# EAGLE design Woolllf Open Weeve (EAGLE 9.6.2)
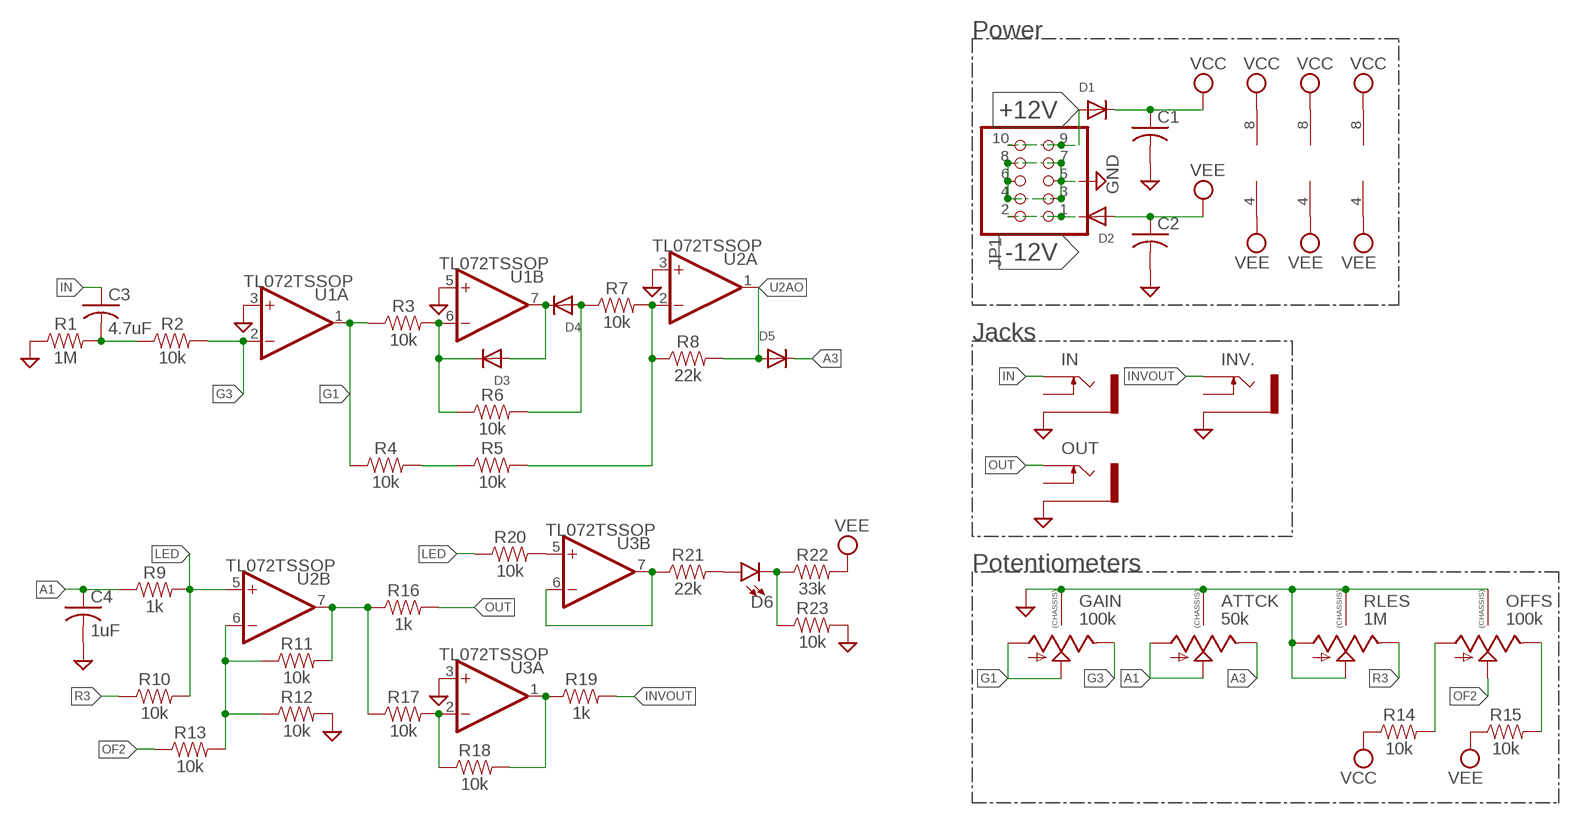
[diagram p0: schematic, sheet 1]

## Parts
ATTCK  50k  9MM_SNAP-IN_POT_CHASSIS  [9MM_SNAP-IN_POT]
C1  C-USC1206  [C1206]
C2  C-USC1206  [C1206]
C3  4.7uF  C-USC0603  [C0603]
C4  1uF  C-USC0603  [C0603]
D1  DIODESOD-123  [SOD-123]
D2  DIODESOD-123  [SOD-123]
D3  DIODESOD-123  [SOD-123]
D4  DIODESOD-123  [SOD-123]
D5  DIODESOD-123  [SOD-123]
D6  LED3MM  [LED_3MM]
GAIN  100k  9MM_SNAP-IN_POT_CHASSIS  [9MM_SNAP-IN_POT]
IN  THONKICONNOLD  [THONKICONN]
INV.  THONKICONNOLD  [THONKICONN]
JP1  PINHD-2X5  [2X05]
OFFS  100k  9MM_SNAP-IN_POT_CHASSIS  [9MM_SNAP-IN_POT]
OUT  THONKICONNOLD  [THONKICONN]
R1  1M  RESISTOR0603  [0603]
R2  10k  RESISTOR0603  [0603]
R3  10k  RESISTOR0603  [0603]
R4  10k  RESISTOR0603  [0603]
R5  10k  RESISTOR0603  [0603]
R6  10k  RESISTOR0603  [0603]
R7  10k  RESISTOR0603  [0603]
R8  22k  RESISTOR0603  [0603]
R9  1k  RESISTOR0603  [0603]
R10  10k  RESISTOR0603  [0603]
R11  10k  RESISTOR0603  [0603]
R12  10k  RESISTOR0603  [0603]
R13  10k  RESISTOR0603  [0603]
R14  10k  RESISTOR0603  [0603]
R15  10k  RESISTOR0603  [0603]
R16  1k  RESISTOR0603  [0603]
R17  10k  RESISTOR0603  [0603]
R18  10k  RESISTOR0603  [0603]
R19  1k  RESISTOR0603  [0603]
R20  10k  RESISTOR0603  [0603]
R21  22k  RESISTOR0603  [0603]
R22  33k  RESISTOR0603  [0603]
R23  10k  RESISTOR0603  [0603]
RLES  1M  9MM_SNAP-IN_POT_CHASSIS  [9MM_SNAP-IN_POT]
U1  TL072TSSOP  [TSSOP-8]
U2  TL072TSSOP  [TSSOP-8]
U3  TL072TSSOP  [TSSOP-8]

## Nets
+12V: D1.A JP1.9 JP1.10
-12V: D2.C JP1.1 JP1.2
A1: ATTCK.1(A) ATTCK.2(S) C4.1 R9.1
A3: ATTCK.3(E) D5.C
G1: GAIN.1(A) GAIN.2(S) R3.1 R4.1 U1.1(A:OUT)
G3: GAIN.3(E) R2.2 U1.2(A:-IN)
GND: ATTCK.CHASSIS1 ATTCK.CHASSIS2 C1.2 C2.2 C4.2 GAIN.CHASSIS1 GAIN.CHASSIS2 IN.P$1_SLEEVE(SLEEVE) INV..P$1_SLEEVE(SLEEVE) JP1.3 JP1.4 JP1.5 JP1.6 JP1.7 JP1.8 OFFS.CHASSIS1 OFFS.CHASSIS2 OUT.P$1_SLEEVE(SLEEVE) R1.1 R12.2 R23.2 RLES.1(A) RLES.2(S) RLES.CHASSIS1 RLES.CHASSIS2 U1.3(A:+IN) U1.5(B:+IN) U2.3(A:+IN) U3.3(A:+IN)
IN: C3.1 IN.P$3_TIP(TIP)
INVOUT: INV..P$3_TIP(TIP) R19.2
LED: R9.2 R10.2 R20.1 U2.5(B:+IN)
N$3: C3.2 R1.2 R2.1
N$4: D3.C R3.2 R6.1 U1.6(B:-IN)
N$5: D3.A D4.C U1.7(B:OUT)
N$6: D4.A R6.2 R7.1
N$7: R20.2 U3.5(B:+IN)
N$8: R4.2 R5.1
N$9: R5.2 R7.2 R8.1 U2.2(A:-IN)
N$10: R11.1 R12.1 R13.2 U2.6(B:-IN)
N$11: R11.2 R16.1 R17.1 U2.7(B:OUT)
N$12: OFFS.1(A) R14.2
N$13: OFFS.3(E) R15.2
N$14: R17.2 R18.1 U3.2(A:-IN)
N$15: R18.2 R19.1 U3.1(A:OUT)
N$16: R21.1 U3.6(B:-IN) U3.7(B:OUT)
N$17: D6.A R21.2
N$18: D6.K(C) R22.1 R23.1
OF2: OFFS.2(S) R13.1
OUT: OUT.P$3_TIP(TIP) R16.2
R3: R10.1 RLES.3(E)
U2AO: D5.A R8.2 U2.1(A:OUT)
VCC: C1.1 D1.C R14.1 U1.8(P:V+) U2.8(P:V+) U3.8(P:V+)
VEE: C2.1 D2.A R15.1 R22.2 U1.4(P:V-) U2.4(P:V-) U3.4(P:V-)
Unconnected: IN.P$2_SWITCH(SWITCH) INV..P$2_SWITCH(SWITCH) OUT.P$2_SWITCH(SWITCH)

## Notes on the sheet
- Power
- Jacks
- Potentiometers

## Library data of the parts
ATTCK GAIN OFFS RLES = MusicThingModular:9MM_SNAP-IN_POT_CHASSIS: 9mm vertical snap-in pot, Alpha / Panasonic style, with a connection to the metal chassis for grounding
C1-C4 = adafruit:C-US: CAPACITOR, American symbol
D1-D5 = adafruit:DIODE: Diode SMADIODE - SMA Surface Mount Package 20V 1A Schottky Diode Digikey: 641-1014-6-ND DO-1N4148 - Through Hole Small Current Diode SOD-123 20V 1 A (.5mV Vf) Schottky Diode - Digikey: MBRX120TPMSCT-ND SOD-323 10V 570mA (.38mV Vf, 3ns) Schottky Diode - Digikey: ZLLS410CT-ND SOD-523 30V 30mA Schottky Diode (RB751S-40TE61) - Digikey: RB751S-40TE61CT-ND SOT23-R/W - SOT23 Package (R = Solder Paste/Reflow Ovens, W = Hand-Soldering) BAT54Film 40V 300mA - Digikey: 497-7162-1-ND
D6 = SparkFun-LED:LED: LED (Generic) Standard schematic elements and footprints for 5mm, 3mm, 1206, and 0603 sized LEDs. Generic LEDs with no color specified.; PROD_ID: DIO-08794
IN INV. OUT = MusicThingModular:THONKICONN: 3.5mm socket for Eurorack modular synths
JP1 = pinhead:PINHD-2X5: PIN HEADER
R1-R23 = SparkFun-Resistors:RESISTOR: Generic Resistor Package
U1-U3 = MusicThingModular:TL072: Generic Dual Op Amp

## Board
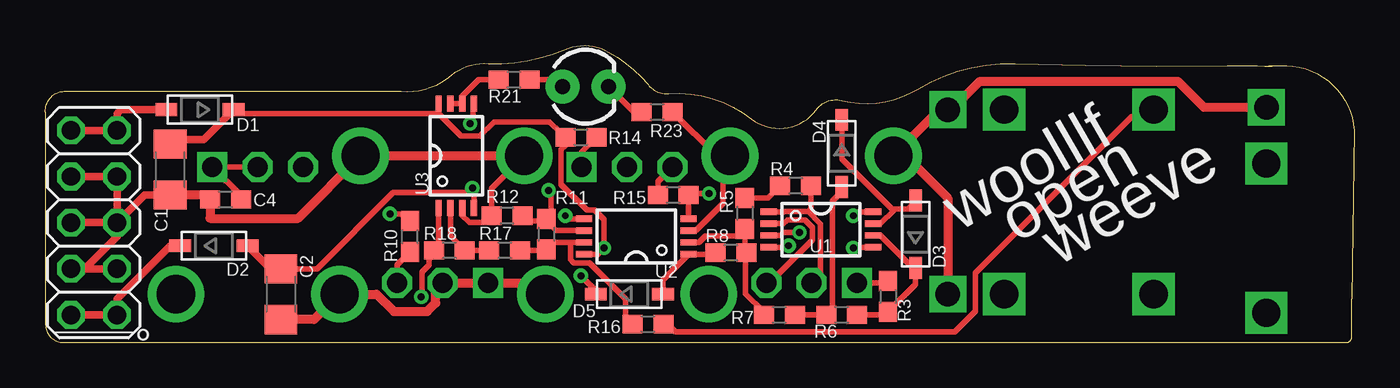
[diagram p1: board, top side]
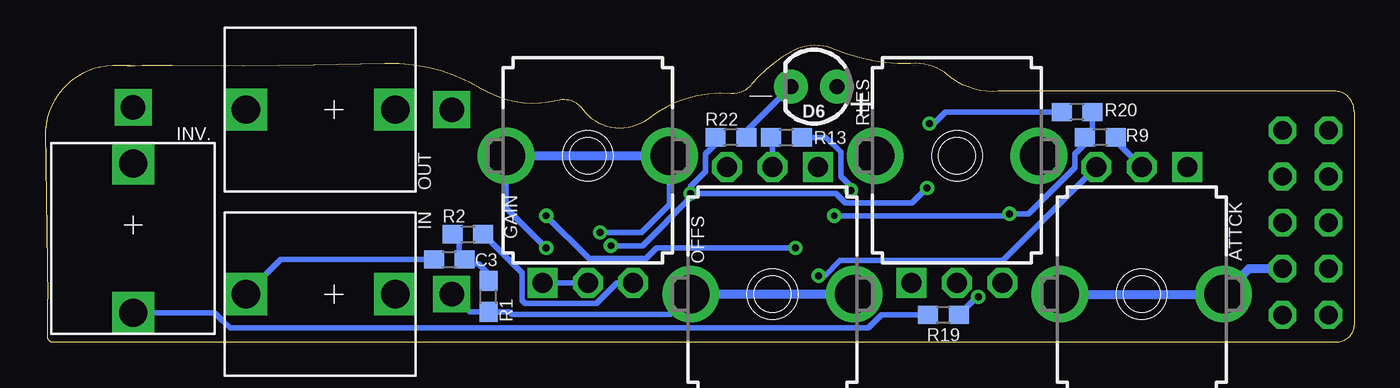
[diagram p2: board, bottom side, seen from below]

Size 72.01 x 16.37 mm. Coordinates in mm from the lower left corner, seen from the top.
Outline: 67.95,15.24 arc-1 66.68,15.24 arc1 65.03,15.24 arc-3 53.34,15.37 arc33 48.01,13.97 arc-45 43.82,13.34 arc68 42.42,12.83 arc-92 38.86,12.32 arc42 34.29,13.72 arc-56 33.15,14.22 arc21 30.99,16 arc56 28.58,16.13 arc-24 24.39,15.37 arc46 22.35,14.73 arc-46 19.56,13.84 1.02,13.84 arc90 0,12.7 0,1 arc90 1,0 71.57,0 arc90 71.88,0.32 71.88,2.41 72.01,11.68 arc90 67.95,15.24
Outline: 67.31,15.24 67.95,15.24
Copper layers (1*16): Top 0.035mm / dielectric 1.5mm / Bottom 0.035mm
Design rules "default *": minimum track width 6mil, minimum drill 0.35mm, track to track 6mil, track to pad 6mil, pad to pad 6mil, via to via 6mil, smd to smd 6mil, copper to edge 14mil, drill to drill 6mil, minimum pad ring 10mil, minimum via ring 8mil, stop-mask expansion 4mil, vias tented up to drill 0mil, thermal gap 10mil

### Footprints (pad centres in the part's own frame; a part is rotated, then mirrored left to right if it is on the bottom)
9MM_SNAP-IN_POT = drill 1.1 square: 1 -2.5,-7 | drill 1.1 octagon: 2 0,-7; 3 2.5,-7 | drill 2.1 pad 2.794: CHASSIS1 -4.5,0; CHASSIS2 4.5,0
C1206 = smd 1.6 x 1.8: 1 -1.4,0; 2 1.4,0
C0603 = smd 1.1 x 1: 1 -0.85,0; 2 0.85,0
SOD-123 = smd 1.2 x 0.7: A 1.85,0; C -1.85,0
LED_3MM = drill 0.813 pad 1.88: A -1.27,0; K 1.27,0
THONKICONN = drill 1.35 square: P$1_SLEEVE 0,-6.48 | drill 1.55 square: P$2_SWITCH 0,-3.38; P$3_TIP 0,4.84
2X05 = drill 1.016 octagon: 1 -5.08,-1.27; 2 -5.08,1.27; 3 -2.54,-1.27; 4 -2.54,1.27; 5 0,-1.27; 6 0,1.27; 7 2.54,-1.27; 8 2.54,1.27; 9 5.08,-1.27; 10 5.08,1.27
0603 = smd 1.1 x 1: 1 -0.85,0; 2 0.85,0
TSSOP-8 = smd 0.9 x 0.35: 1 -2.875,0.975; 2 -2.875,0.325; 3 -2.875,-0.325; 4 -2.875,-0.975; 5 2.875,-0.975; 6 2.875,-0.325; 7 2.875,0.325; 8 2.875,0.975

### Placement (x,y rotation side)
ATTCK  11.69,2.67 180 bottom
C1  6.86,9.53 270 top
C2  12.96,2.67 270 top
C3  49.79,4.57 0 bottom
C4  9.91,7.87 180 top
D1  8.51,12.83 180 top
D2  9.27,5.33 0 top
D3  47.88,5.97 90 top
D4  43.82,10.41 270 top
D5  32.13,2.67 0 top
D6  29.72,14.1 180 bottom
GAIN  42.17,10.29 0 bottom
IN  56.14,2.67 90 bottom
INV.  67.18,6.48 180 bottom
JP1  2.67,6.6 90 top
OFFS  32.01,2.67 180 bottom
OUT  56.14,12.83 90 bottom
R1  47.63,2.54 90 bottom
R2  48.77,5.97 0 bottom
R3  46.36,2.54 270 top
R4  41.28,8.64 180 top
R5  38.48,7.11 270 top
R6  43.82,1.52 180 top
R7  40.39,1.52 180 top
R8  37.72,4.95 180 top
R9  13.97,11.3 180 bottom
R10  20.07,5.84 90 top
R11  27.56,5.97 270 top
R12  25.4,6.99 180 top
R13  31.24,11.3 0 bottom
R14  29.47,11.3 0 top
R15  34.55,8.13 180 top
R16  33.15,1.02 0 top
R17  25.27,5.08 180 top
R18  22.23,5.08 180 top
R19  22.61,1.52 180 bottom
R20  15.24,12.7 180 bottom
R21  25.78,14.48 0 top
R22  34.29,11.3 180 bottom
R23  33.66,12.7 0 top
RLES  21.85,10.29 0 bottom
U1  42.67,6.22 0 top
U2  32.51,5.84 180 top
U3  22.61,10.29 90 top

### Tracks (layer width: path | path; a pad name or v marks a point on that pad's centre or on a via)
+12V
  Top 0.406: JP1.10 JP1.9 3.94,12.62 4.15,12.83 D1.A
-12V
  Top 0.406: JP1.2 JP1.1 3.94,2.41 6.86,5.33 D2.C
A1
  Top 0.305: ATTCK.2 ATTCK.1 10.76,8.1 C4.1
  Bottom 0.305: R9.1 13.12,11.1 ATTCK.2
A3  (via drill 0.38)
  Top 0.305: v29.47,3.68 30.28,2.87 D5.C
  Bottom 0.305: v29.47,3.68 29.12,3.68 28.28,4.53 19.32,4.53 ATTCK.3
G1
  Top 0.305: R3.1 46.25,3.29 GAIN.1 | 41.98,7.22 42.65,6.54 42.65,3.77 GAIN.2 | R4.1 42.13,7.37 41.98,7.22 | U1.1 40.62,7.2 40.64,7.22 41.98,7.22
  Bottom 0.305: GAIN.2 GAIN.1
G3
  Top 0.305: U1.2 40.61,6.55 40.83,6.76 41.79,6.76 42.2,6.35 42.2,5.65 39.84,3.29 GAIN.3
  Bottom 0.305: R2.2 45.8,3.85 45.8,2.34 45.62,2.16 41.7,2.16 40.57,3.29 GAIN.3
GND  (via drill 0.38)
  Top 0.305: RLES.2 21.97,3.29 | RLES.CHASSIS1 24.55,8.49 R12.2 24.17,6.6 23.33,6.6 22.93,7.01 U3.3 | U1.3 40.43,5.9 40.6,6.06 v41.5,6.06 | U2.3 35.79,6.17 37.28,7.66 37.28,9.91 GAIN.CHASSIS2 36.92,10.29 R23.2 | U1.5 44.49,5.25 v44.45,5.21
  Top 0.406: JP1.8 JP1.7 JP1.5 | JP1.4 2.16,4.06 | 2.16,4.06 JP1.3 | JP1.6 JP1.5 | JP1.5 3.94,5.84 2.16,4.06 | JP1.5 5.46,8.12 C1.2
  Top 0.508: C2.2 14.79,1.27 ATTCK.CHASSIS2 18.22,2.67 19.18,1.72 21.01,1.72 21.48,2.18 21.48,2.79 21.97,3.29 | C1.2 8.81,8.12 C4.2 9.06,6.84 13.9,6.84 RLES.CHASSIS2 RLES.CHASSIS1 | IN.P$1_SLEEVE 49.66,7.95 47.32,10.29 GAIN.CHASSIS1 49.21,12.83 OUT.P$1_SLEEVE 49.86,12.83 51.42,14.4 62.31,14.4 63.75,12.96 INV..P$1_SLEEVE | RLES.2 RLES.1 26.89,3.29 OFFS.CHASSIS1
  Bottom 0.305: IN.P$1_SLEEVE 48.68,1.69 R1.1 46.48,1.69 46.36,1.56 37.61,1.56 36.67,2.5 | v41.5,6.06 39.21,6.06 37.67,7.61 GAIN.CHASSIS2 | v44.45,5.21 46.67,7.42 GAIN.CHASSIS1
  Bottom 0.508: JP1.3 5.79,4.06 ATTCK.CHASSIS1 ATTCK.CHASSIS2 | GAIN.CHASSIS1 GAIN.CHASSIS2 | OFFS.CHASSIS1 OFFS.CHASSIS2 36.67,2.5
IN
  Bottom 0.305: C3.1 59.07,4.57 IN.P$3_TIP
INVOUT
  Bottom 0.305: R19.2 26.01,1.52 26.73,0.8 61.85,0.8 62.25,1.2 62.26,1.2 62.7,1.64 INV..P$3_TIP
LED  (via drill 0.38)
  Top 0.305: v18.96,7.09 19.59,7.09 19.86,6.82 19.94,6.82 R10.2 | U2.5 28.88,6.82 28.71,6.99 v28.61,6.99
  Bottom 0.305: R20.1 14.39,11.73 R9.2 14.82,10.92 15.36,10.39 15.36,9.64 17.91,7.09 v18.96,7.09 19.06,6.99 v28.61,6.99
N$3
  Bottom 0.305: R1.2 47.63,3.77 48.17,4.32 48.68,4.32 C3.2 49.06,4.57 49.24,4.75 49.24,5.59 R2.1
N$4
  Top 0.305: R6.1 46.19,1.52 R3.2 47.88,3.21 D3.C 47.73,4.12 45.95,5.9 U1.6
N$5
  Top 0.305: D4.C 43.82,10.12 46.66,7.28 | U1.7 45.95,6.55 46.69,7.28 46.66,7.28 | 46.66,7.28 46.74,7.37 47.5,7.37 47.88,7.75 D3.A
N$6
  Top 0.305: R7.1 R6.2 43.3,1.85 43.3,7.79 43.82,8.31 D4.A
N$7  (via drill 0.38)
  Top 0.305: U3.5 23.62,13.12 23.54,13.04 23.54,12.23 v23.37,12.06
  Bottom 0.305: R20.2 22.48,12.7 23.12,12.06 v23.37,12.06
N$8
  Top 0.305: R5.1 39.75,7.96 R4.2
N$9
  Top 0.305: R7.2 39.54,1.69 38.54,2.69 38.54,4.92 R8.1 38.59,4.97 38.48,5.08 R5.2 38.1,5.88 36.32,5.88 35.95,5.52 U2.2
N$10  (via drill 0.38)
  Top 0.305: R12.1 26.54,6.69 27.43,6.69 R11.1 | R11.1 27.56,6.69 28.09,6.17 U2.6 | R11.1 27.81,7.07 27.81,8.26 v27.69,8.38
  Bottom 0.305: v27.69,8.38 27.69,8.6 28.25,9.16 28.25,10.49 29.06,11.3 R13.2
N$11
  Top 0.305: R17.1 27.52,5.08 R11.2 27.96,5.52 28.83,5.52 | U2.7 28.83,5.52 | 28.83,5.52 28.88,5.46 28.88,4.57 29.06,4.39 29.94,4.39 31.92,2.41 31.92,1.4 R16.1
N$12
  Top 0.305: OFFS.1 29.51,10.49 R14.2
N$13
  Top 0.305: R15.2 33.7,8.86 OFFS.3
N$14
  Top 0.305: U3.2 22.28,5.87 R18.1 R17.2
N$15  (via drill 0.38)
  Top 0.305: U3.1 21.63,5.34 R18.2 21.38,4.83 21.12,4.57 21.12,4.29 20.72,3.88 20.72,2.55 v20.68,2.52
  Bottom 0.305: v20.68,2.52 20.77,2.52 R19.1
N$16
  Top 0.305: U3.7 U3.6 22.93,13.57 23.84,14.48 R21.1
N$17
  Top 0.305: R21.2 28.07,14.48 D6.A
N$18
  Top 0.305: D6.K 32.39,12.7 R23.1
  Bottom 0.305: D6.K 33.44,11.64 R22.1
OF2
  Bottom 0.305: OFFS.2 32.01,11.21 R13.1
OUT
  Top 0.305: R16.2 34.25,1.02 34.68,0.59 50.04,0.59 51.16,1.72 51.16,3.83 59.78,12.45 60.59,12.45 OUT.P$3_TIP
R3
  Top 0.305: RLES.3 19.35,4.27 R10.1
U2AO
  Top 0.305: R8.2 36.78,4.87 U2.1 33.98,3.46 D5.A
VCC  (via drill 0.38)
  Top 0.305: v44.45,6.99 44.66,7.2 U1.8 | U2.8 30.4,4.87 v30.74,5.21 30.74,6.78 30.21,7.3 29.79,7.3 28.38,8.72 28.38,10.62 28.62,10.86 R14.1 28.36,11.56 28.34,11.56 27.75,12.15 24.68,12.15 23.9,11.37 22.88,11.37 21.63,12.61 | 21.63,12.61 U3.8 | 21.63,12.61 10.57,12.61 D1.C
  Top 0.406: D1.C 8.71,11.18 7.11,11.18 C1.1
  Bottom 0.305: v30.74,5.21 38.39,5.21 38.96,4.64 42.1,4.64 v44.45,6.99
VEE  (via drill 0.38)
  Top 0.305: U1.4 40.81,5.25 v40.9,5.33 | C2.1 14.95,4.07 19.14,8.26 23.24,8.26 v23.5,8.51 23.58,8.43 U3.4 | v36.51,8.21 35.48,8.21 R15.1 U2.4
  Top 0.406: D2.A 12.39,4.07 C2.1
  Bottom 0.305: R22.2 35.14,10.92 35.68,10.39 35.68,9.43 36.51,8.59 v36.51,8.21 | v36.51,8.21 36.51,7.99 39.16,5.33 v40.9,5.33 | v23.5,8.51 24.32,7.68 27.98,7.68 28.5,8.21 v36.51,8.21

### Text on the board
tPlace: woolllf | open | weeve | _____ | °
bPlace: __ | +